# Altium schematic sheet Mico_SDCard_SDIO.SchDoc
size A4
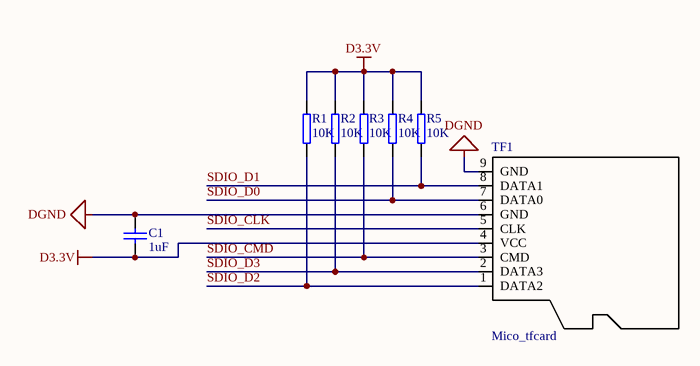
[diagram p0: Mico_SDCard_SDIO.SchDoc]

## Parts
C1  1uF  [0603C]
R1  10K  [0402R]
R2  10K  [0402R]
R3  10K  [0402R]
R4  10K  [0402R]
R5  10K  [0402R]
TF1  Mico_tfcard  [Micro_SDCard]

## Nets
D3.3V: C1.1 R1.2 R2.2 R3.2 R4.2 R5.2 TF1.4(VCC)
DGND: C1.2 TF1.6(GND) TF1.9(GND)
SDIO_CLK: TF1.5(CLK)
SDIO_CMD: R3.1 TF1.3(CMD)
SDIO_D0: R4.1 TF1.7(DATA0)
SDIO_D1: R5.1 TF1.8(DATA1)
SDIO_D2: R1.1 TF1.1(DATA2)
SDIO_D3: R2.1 TF1.2(DATA3)

## Library data of the parts
C1 = Cap: 贴片电容
R1-R5 = RES-10K